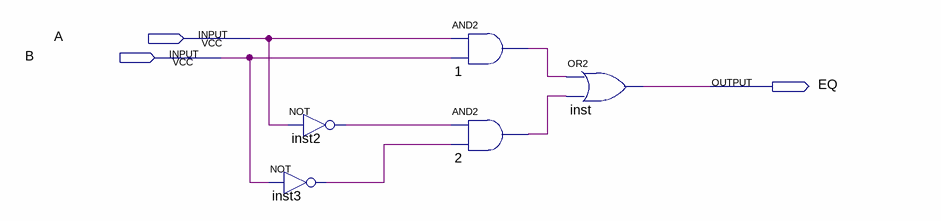
[diagram p0: schematic sheet]
// Quartus schematic Equal_1bit.bdf as structural Verilog: 5 symbols, 3 pins
module Equal_1bit (
  input  A,
  input  B,
  output EQ
);

  wire inst2_out, inst3_out, n1_out, n2_out;

  not inst3 (inst3_out, B);
  not inst2 (inst2_out, A);
  and u_1 (n1_out, A, B);
  and u_2 (n2_out, inst2_out, inst3_out);
  or inst (EQ, n1_out, n2_out);
endmodule
